# EAGLE design thermo_r1 (EAGLE 9.2.2)
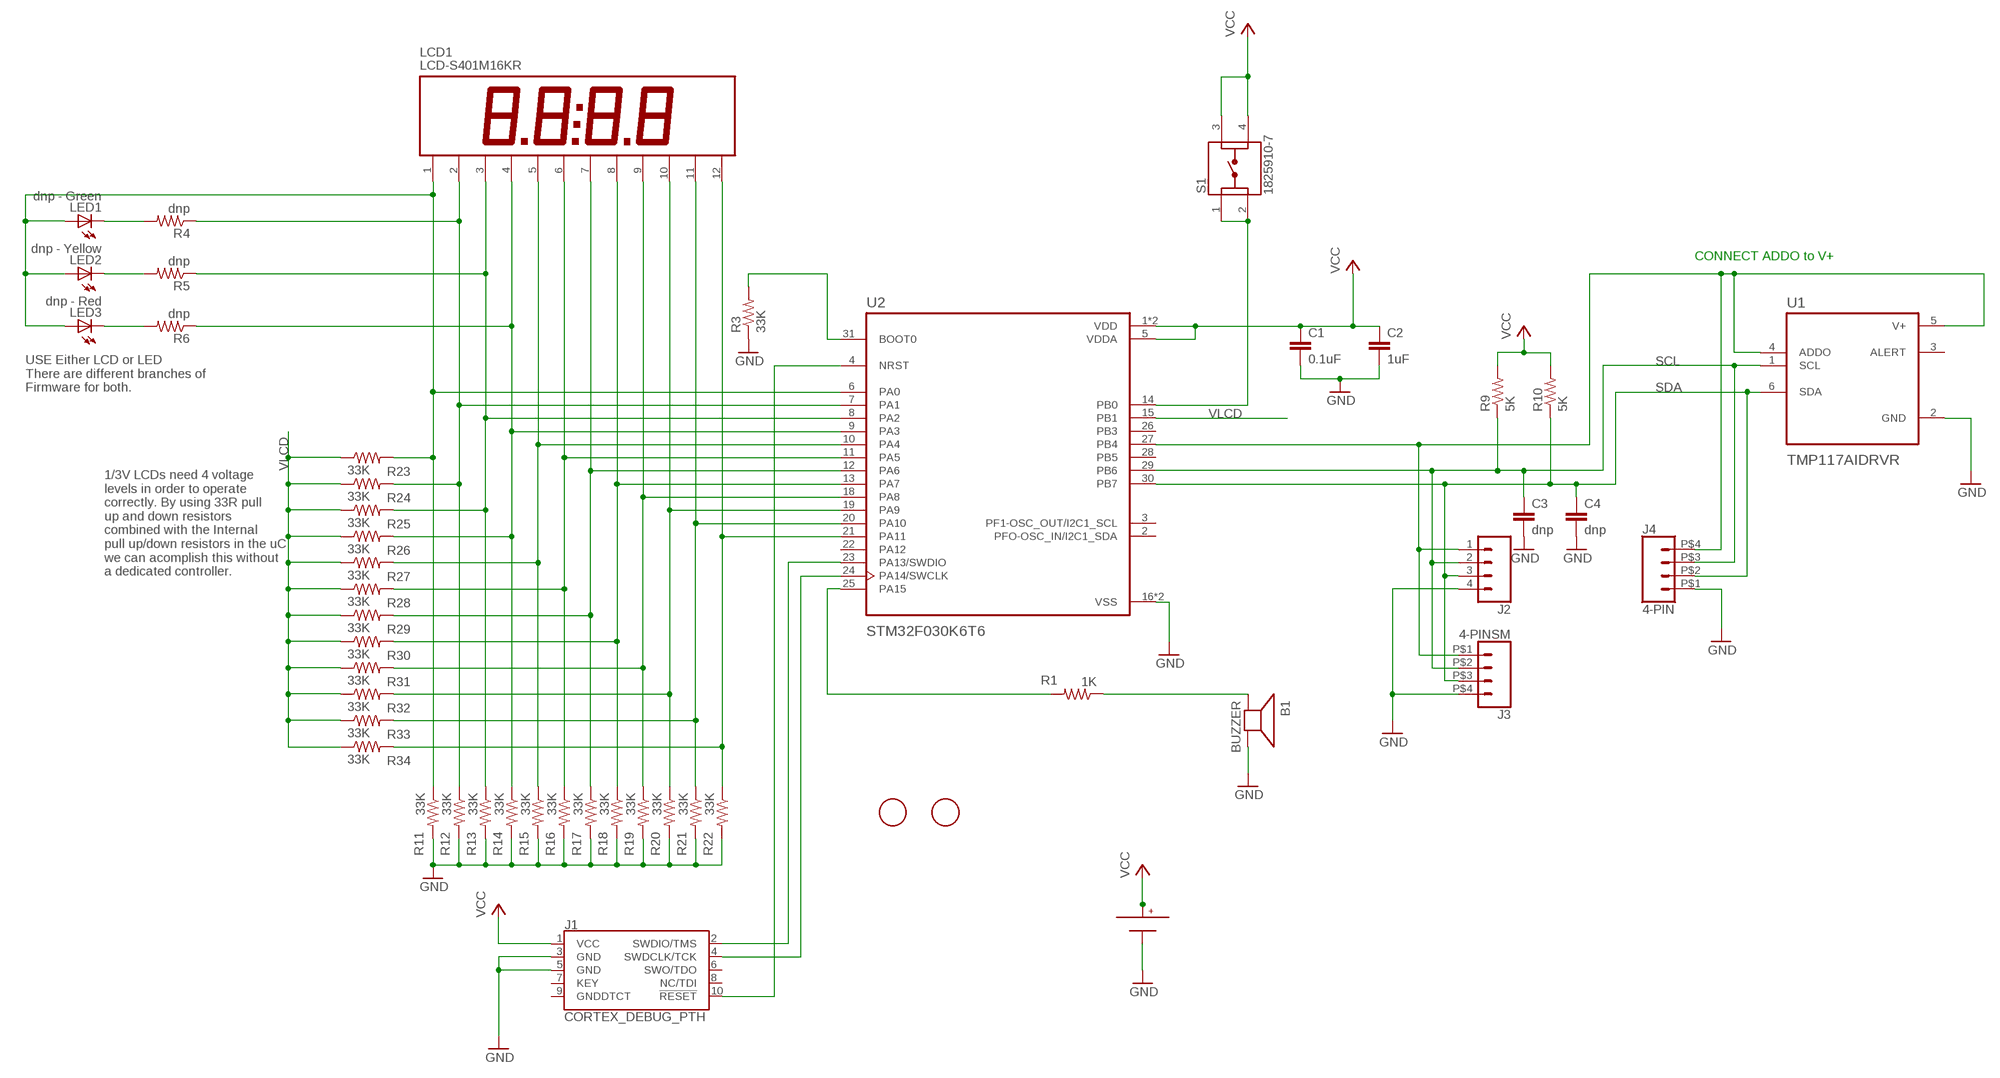
[diagram p0: schematic, sheet 1]

## Parts
B1  BUZZER  [PLKCS1212E]
BT1  BAT-HLD-001  [BAT-HLD-001]
C1  0.1uF  CAPACITORC0603  [R0603]
C2  1uF  CAPACITORC0603  [R0603]
C3  dnp  CAPACITORC0603  [R0603]
C4  dnp  CAPACITORC0603  [R0603]
J1  CORTEX_DEBUG_PTH  [2X5-PTH-1.27MM]
J2  CONN_041.27MM  [1X04_1.27MM]
J3  4-PINSM  [4PIN_1MM]
J4  4-PIN  [2X2PIN_1MM]
LCD1  LCD-S401M16KR  [LCD-S401M16KR]
LED1  dnp - Green  LEDCHIP-LED0805  [CHIP-LED0805]
LED2  dnp - Yellow  LEDCHIP-LED0805  [CHIP-LED0805]
LED3  dnp - Red  LEDCHIP-LED0805  [CHIP-LED0805]
R1  1K  RESISTORR0603  [R0603]
R3  33K  RESISTORR0603  [R0603]
R4  dnp  RESISTORR0603  [R0603]
R5  dnp  RESISTORR0603  [R0603]
R6  dnp  RESISTORR0603  [R0603]
R9  5K  RESISTORR0603  [R0603]
R10  5K  RESISTORR0603  [R0603]
R11  33K  RESISTORR0603  [R0603]
R12  33K  RESISTORR0603  [R0603]
R13  33K  RESISTORR0603  [R0603]
R14  33K  RESISTORR0603  [R0603]
R15  33K  RESISTORR0603  [R0603]
R16  33K  RESISTORR0603  [R0603]
R17  33K  RESISTORR0603  [R0603]
R18  33K  RESISTORR0603  [R0603]
R19  33K  RESISTORR0603  [R0603]
R20  33K  RESISTORR0603  [R0603]
R21  33K  RESISTORR0603  [R0603]
R22  33K  RESISTORR0603  [R0603]
R23  33K  RESISTORR0603  [R0603]
R24  33K  RESISTORR0603  [R0603]
R25  33K  RESISTORR0603  [R0603]
R26  33K  RESISTORR0603  [R0603]
R27  33K  RESISTORR0603  [R0603]
R28  33K  RESISTORR0603  [R0603]
R29  33K  RESISTORR0603  [R0603]
R30  33K  RESISTORR0603  [R0603]
R31  33K  RESISTORR0603  [R0603]
R32  33K  RESISTORR0603  [R0603]
R33  33K  RESISTORR0603  [R0603]
R34  33K  RESISTORR0603  [R0603]
S1  1825910-7  [SW_1825910-7]
U1  TMP117AIDRVR  [SON65P200X200X80-7N]
U2  STM32F030K6T6  [QFP80P900X900X160-32N]
U$5  FIDUCIAL  [FIDUCIAL_1MM]
U$6  FIDUCIAL  [FIDUCIAL_1MM]

## Nets
GND: B1.P$2(-) BT1.- C1.2 C2.2 C3.2 C4.2 J1.3(GND) J1.5(GND) J2.4 J3.P$4 J4.P$1 R3.1 R11.2 R12.2 R13.2 R14.2 R15.2 R16.2 R17.2 R18.2 R19.2 R20.2 R21.2 R22.2 U1.2(GND) U2.16(VSS) U2.32(VSS)
N$1: J1.4(SWDCLK/TCK) U2.24(PA14/SWCLK)
N$2: LCD1.2 R4.1 R12.1 R24.2 U2.7(PA1)
N$3: LCD1.3 R5.1 R13.1 R25.2 U2.8(PA2)
N$4: LCD1.4 R6.1 R14.1 R26.2 U2.9(PA3)
N$5: LCD1.5 R15.1 R27.2 U2.10(PA4)
N$6: LCD1.6 R16.1 R28.2 U2.11(PA5)
N$7: LCD1.7 R17.1 R29.2 U2.12(PA6)
N$8: LCD1.8 R18.1 R30.2 U2.13(PA7)
N$9: LCD1.9 R19.1 R31.2 U2.18(PA8)
N$10: LCD1.10 R20.1 R32.2 U2.19(PA9)
N$11: LCD1.11 R21.1 R33.2 U2.20(PA10)
N$12: LCD1.12 R22.1 R34.2 U2.21(PA11)
N$13: R1.2 U2.25(PA15)
N$14: R3.2 U2.31(BOOT0)
N$15: J1.10(!RESET) U2.4(NRST)
N$16: J1.2(SWDIO/TMS) U2.23(PA13/SWDIO)
N$17: B1.P$1(+) R1.1
N$23: LED3.C R6.2
N$24: S1.1 S1.2 U2.14(PB0)
N$25: LED2.C R5.2
N$26: LED1.C R4.2
N$27: LCD1.1 LED1.A LED2.A LED3.A R11.1 R23.2 U2.6(PA0)
SCL: C3.1 J2.2 J3.P$2 J4.P$3 R9.1 U1.1(SCL) U2.29(PB6)
SDA: C4.1 J2.3 J3.P$3 J4.P$2 R10.1 U1.6(SDA) U2.30(PB7)
VCC: BT1.+@1(+) BT1.+@2(+) C1.1 C2.1 J1.1(VCC) R9.2 R10.2 S1.3 S1.4 U2.1(VDD) U2.5(VDDA) U2.17(VDD)
VLCD: R23.1 R24.1 R25.1 R26.1 R27.1 R28.1 R29.1 R30.1 R31.1 R32.1 R33.1 R34.1 U2.15(PB1)
VT: J2.1 J3.P$1 J4.P$4 U1.4(ADDO) U1.5(V+) U2.27(PB4)
Unconnected: J1.6(SWO/TDO) J1.7(KEY) J1.8(NC/TDI) J1.9(GNDDTCT) U1.3(ALERT) U2.2(PFO-OSC_IN/I2C1_SDA) U2.3(PF1-OSC_OUT/I2C1_SCL) U2.22(PA12) U2.26(PB3) U2.28(PB5)

## Notes on the sheet
- CONNECT ADDO to V+
- USE Either LCD or LED
  There are different branches of 
  Firmware for both.
- 1/3V LCDs need 4 voltage
  levels in order to operate
  correctly. By using 33R pull 
  up and down resistors 
  combined with the Internal
  pull up/down resistors in the uC
  we can acomplish this without
  a dedicated controller.

## Library data of the parts
B1 = Passives:BUZZER
BT1 = BAT-HLD-001:BAT-HLD-001: Linx Technologies BAT-HLD-001 surface mount CR2032 single-cell holder digikey: BAT-HLD-001-ND; AVAILABILITY: Unavailable; DESCRIPTION: Battery Retainer Coin, 20.0mm 1 Cell SMD _SMT_ Tab; MF: Linx Technologies; MP: BAT-HLD-001; PACKAGE: None; PRICE: None
C1-C4 = Passives:CAPACITOR
J1 = SparkFun-Connectors:CORTEX_DEBUG: Cortex Debug Connector - 10 pin Supports JTAG debug, Serial Wire debug, and Serial Wire Viewer. PTH and SMD connector options available. General Connector Information <http://infocenter.arm.com/help/topic/com.arm.doc.faqs/attached/13634/cortex_debug_connectors.pdf> Products: PTH Connector <http://www.digikey.com/product-detail/en/cnc-tech/3220-10-0100-00/1175-1627-ND/3883661> -via Digi-Key SparkFun PSoc <https://www.sparkfun.com/products/13229> SparkFun T <https://www.sparkfun.com/products/13810>
J2 = SparkFun-Connectors:CONN_04: Multi connection point. Often used as Generic Header-pin footprint for 0.1 inch spaced/style header connections On any of the 0.1 inch spaced packages, you can populate with these: Break Away Headers - Straight <https://www.sparkfun.com/products/116> (PRT-00116) Break Away Male Headers - Right Angle <https://www.sparkfun.com/products/553> (PRT-00553) Female Headers <https://www.sparkfun.com/products/115> (PRT-00115) Break Away Headers - Machine Pin <https://www.sparkfun.com/products/117> (PRT-00117) Break Away Female Headers - Swiss Machine Pin <https://www.sparkfun.com/products/743> (PRT-00743) For SCREWTERMINALS and SPRING TERMINALS visit here: Screw Terimnals on SparkFun.com <https://www.sparkfun.com/search/results?term=Screw+Terminals> (5mm/3.5mm/2.54mm spacing) This device is also useful as a general connection point to wire up your design to another part of your project. Our various solder wires solder well into these plated through hole pads. Hook-Up Wire - Assortment (Stranded, 22 AWG) <https://www.sparkfun.com/products/11375> (PRT-11375) Hook-Up Wire - Assortment (Solid Core, 22 AWG) <https://www.sparkfun.com/products/11367> (PRT-11367) View the entire wire category on our website here <https://www.sparkfun.com/categories/141> Special notes: Molex polarized connector foot print use with SKU : PRT-08231 with associated crimp pins and housings. 1MM SMD Version SKU: PRT-10208
J3 J4 = connectors:4-PIN
LCD1 = LCD-S401M16KR:LCD-S401M16KR: LUMEX Four digit 0.17" 7-Segment Custom LCD Panel Reflective; AVAILABILITY: Unavailable; DESCRIPTION: Character LCD Display Module Reflective 7-Segment TN - Twisted Nematic Without Backlight 20.32mm x 10.16mm x 2.80mm; MF: Lumex Opto/Components; MP: LCD-S401M16KR; PACKAGE: None; PRICE: None
LED1-LED3 = led:LED: LED OSRAM: - CHIPLED LG R971, LG N971, LY N971, LG Q971, LY Q971, LO R971, LY R971 LH N974, LH R974 LS Q976, LO Q976, LY Q976 LO Q996 - Hyper CHIPLED LW Q18S LB Q993, LB Q99A, LB R99A - SideLED LS A670, LO A670, LY A670, LG A670, LP A670 LB A673, LV A673, LT A673, LW A673 LH A674 LY A675 LS A676, LA A676, LO A676, LY A676, LW A676 LS A679, LY A679, LG A679 - Hyper Micro SIDELED® LS Y876, LA Y876, LO Y876, LY Y876 LT Y87S - SmartLED LW L88C, LW L88S LB L89C, LB L89S, LG L890 LS L89K, LO L89K, LY L89K LS L896, LA L896, LO L896, LY L896 - TOPLED LS T670, LO T670, LY T670, LG T670, LP T670 LSG T670, LSP T670, LSY T670, LOP T670, LYG T670 LG T671, LOG T671, LSG T671 LB T673, LV T673, LT T673, LW T673 LH T674 LS T676, LA T676, LO T676, LY T676, LB T676, LH T676, LSB T676, LW T676 LB T67C, LV T67C, LT T67C, LS T67K, LO T67K, LY T67K, LW E67C LS E67B, LA E67B, LO E67B, LY E67B, LB E67C, LV E67C, LT E67C LW T67C LS T679, LY T679, LG T679 LS T770, LO T770, LY T770, LG T770, LP T770 LB T773, LV T773, LT T773, LW T773 LH T774 LS E675, LA E675, LY E675, LS T675 LS T776, LA T776, LO T776, LY T776, LB T776 LHGB T686 LT T68C, LB T68C - Hyper Mini TOPLED® LB M676 - Mini TOPLED Santana® LG M470 LS M47K, LO M47K, LY M47K Source: http://www.osram.convergy.de LUXEON: - LUMILED® LXK2-PW12-R00, LXK2-PW12-S00, LXK2-PW14-U00, LXK2-PW14-V00 LXK2-PM12-R00, LXK2-PM12-S00, LXK2-PM14-U00 LXK2-PE12-Q00, LXK2-PE12-R00, LXK2-PE12-S00, LXK2-PE14-T00, LXK2-PE14-U00 LXK2-PB12-K00, LXK2-PB12-L00, LXK2-PB12-M00, LXK2-PB14-N00, LXK2-PB14-P00, LXK2-PB14-Q00 LXK2-PR12-L00, LXK2-PR12-M00, LXK2-PR14-Q00, LXK2-PR14-R00 LXK2-PD12-Q00, LXK2-PD12-R00, LXK2-PD12-S00 LXK2-PH12-R00, LXK2-PH12-S00 LXK2-PL12-P00, LXK2-PL12-Q00, LXK2-PL12-R00 Source: www.luxeon.com KINGBRIGHT: KA-3528ASYC Source: www.kingbright.com
R1 R3-R6 R9-R34 = Passives:RESISTOR
S1 = 1825910-7:1825910-7: Switch Tactile OFF (ON) SPST Round Button PC Pins 0.05A 24VDC 100000Cycles 2.55N Thru-Hole Loose; AVAILABILITY: Unavailable; COMMENT: 1825910-7; CONFIGURATION_POLE-THROW: Single Pole - Single Throw; CONTACT_CURRENT_RATING: 50 mA; DESCRIPTION: Switch Tactile OFF _ON_ SPST Round Button PC Pins 0.05A 24VDC 100000Cycle 2.55N Thru-Hole Loose Piece; EU_ROHS_COMPLIANCE: Compliant; MF: TE Connectivity; MP: 1825910-7; PACKAGE: None; PRICE: None; TE_PURCHASE_URL: https://www.te.com/usa-en/product-1825910-7.html?te_bu=Cor&te_type=disp&te_campaign=seda_glo_cor-seda-global-disp-prtnr-fy19-seda-model-bom-cta_sma-317_1&elqCampaignId=32493
U1 = TMP117AIDRVR:TMP117AIDRVR: None; AVAILABILITY: Unavailable; DESCRIPTION: Temperature Sensor Digital, Local -55°C ~ 150°C 16 b 6-WSON _2x2_; MF: Texas Instruments; MP: TMP117AIDRVR; PACKAGE: WDFN-6 Texas Instruments; PRICE: None
U2 = STM32F030K6T6:STM32F030K6T6: None; AVAILABILITY: Unavailable; DESCRIPTION: ARM® Cortex®-M0 STM32F0 Microcontroller IC 32-Bit 48MHz 32KB _32K x 8_ FLASH 32-LQFP _7x7_; MF: STMicroelectronics; MP: STM32F030K6T6; PACKAGE: LQFP-32 STMicroelectronics; PRICE: None
U$5 U$6 = adafruit:FIDUCIAL: For use by pick and place machines to calibrate the vision/machine, 1mm By microbuilder.eu

## Board
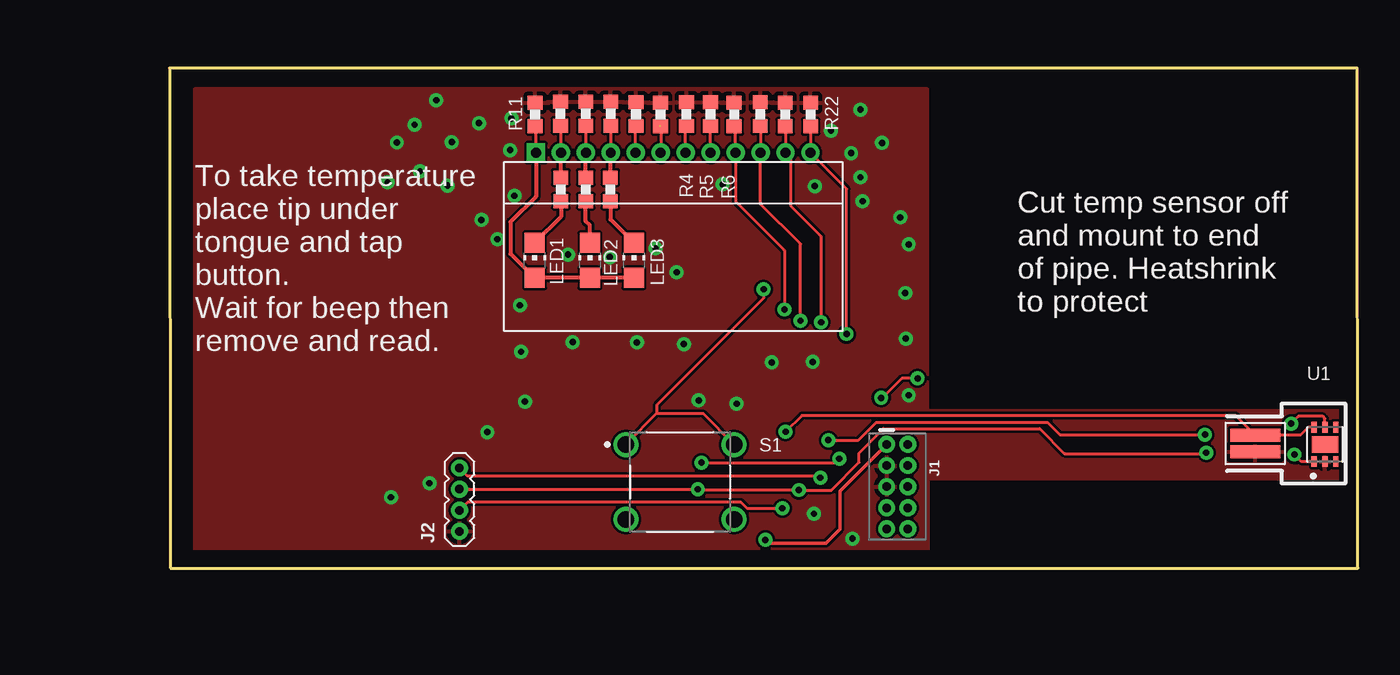
[diagram p1: board, top side]
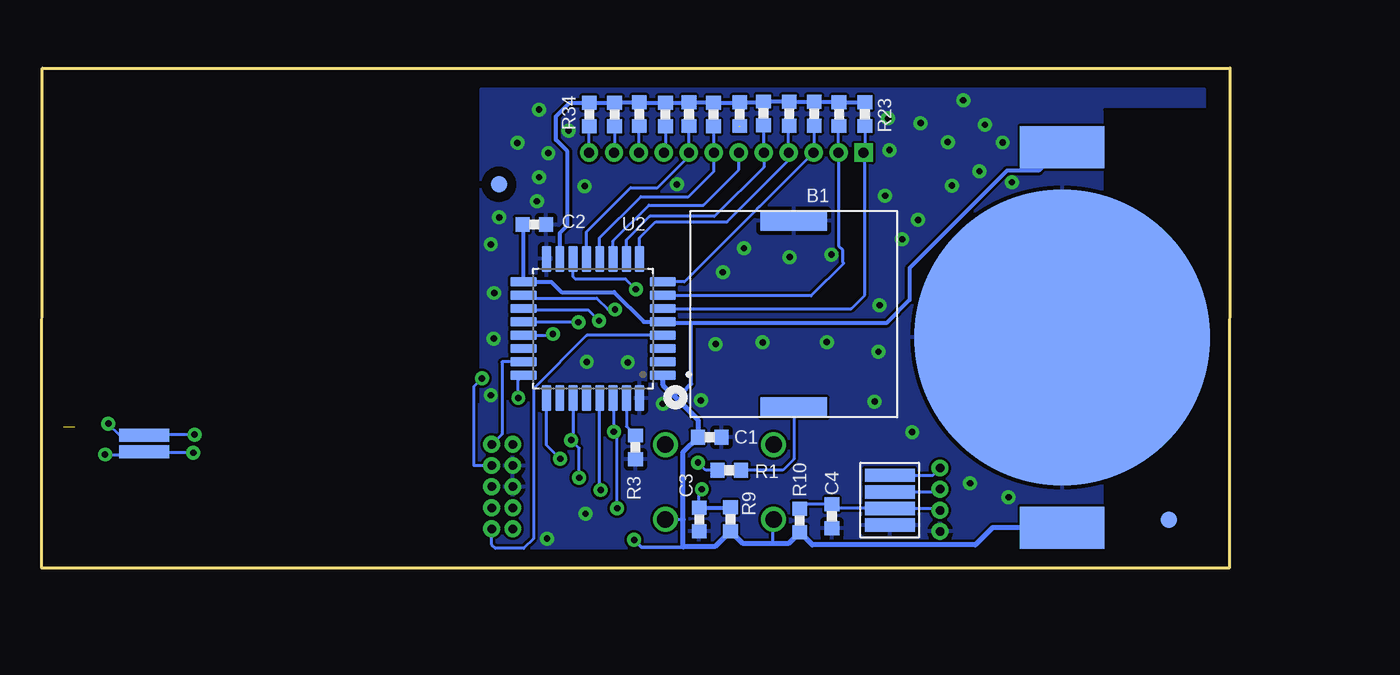
[diagram p2: board, bottom side, seen from below]

Size 71.42 x 30.05 mm. Coordinates in mm from the lower left corner, seen from the top.
Outline: 0.05,0 71.42,0 71.37,30.05 0,30.05 0.05,0
Copper layers (1*16): Top 0.035mm / dielectric 1.5mm / Bottom 0.035mm
Design rules "default *": minimum track width 7mil, minimum drill 15mil, track to track 6mil, track to pad 6mil, pad to pad 6mil, via to via 6mil, smd to smd 6mil, copper to edge 40mil, drill to drill 6mil, minimum pad ring 10mil, minimum via ring 9mil, stop-mask expansion 4mil, vias tented up to drill 16mil, thermal gap 10mil

### Footprints (pad centres in the part's own frame; a part is rotated, then mirrored left to right if it is on the bottom)
PLKCS1212E = smd 1.2 x 4: P$1 -5.6,0; P$2 5.6,0
BAT-HLD-001 = smd 2.54 x 5.08: +@1 -11.43,0; +@2 11.43,0 | smd 17.78 x 17.78: - 0,0
R0603 = smd 0.838 x 0.889: 1 -0.711,0; 2 0.711,0
2X5-PTH-1.27MM = drill 0.508 pad 1: 1 -2.54,-0.635; 2 -2.54,0.635; 3 -1.27,-0.635; 4 -1.27,0.635; 5 0,-0.635; 6 0,0.635; 7 1.27,-0.635; 8 1.27,0.635; 9 2.54,-0.635; 10 2.54,0.635
1X04_1.27MM = drill 0.508 pad 1: 1 0,0; 2 1.27,0; 3 2.54,0; 4 3.81,0
4PIN_1MM = smd 3 x 0.8: P$1 0,1.5; P$2 0,0.5; P$3 0,-0.5; P$4 0,-1.5
2X2PIN_1MM = smd 3 x 0.8: P$1 0,0.5; P$2 0,-0.5 | smd 3 x 0.8 bottom: P$3 0,0.5; P$4 0,-0.5
LCD-S401M16KR = drill 0.6 square: 1 0,0 | drill 0.6: 2 1.5,0; 3 3,0; 4 4.5,0; 5 6,0; 6 7.5,0; 7 9,0; 8 10.5,0; 9 12,0; 10 13.5,0; 11 15,0; 12 16.5,0
CHIP-LED0805 = smd 1.2 x 1.2: A 0,-1.05; C 0,1.05
SW_1825910-7 = drill 0.99: 1 -3.25,2.25; 2 3.25,2.25; 3 -3.25,-2.25; 4 3.25,-2.25
SON65P200X200X80-7N = smd 0.66 x 0.32: 1 -1.03,0.65; 2 -1.03,0; 3 -1.03,-0.65; 4 1.03,-0.65; 5 1.03,0; 6 1.03,0.65 | smd 1 x 1.6: 7 0,0
QFP80P900X900X160-32N = smd 1.56 x 0.55: 1 -4.18,2.8; 2 -4.18,2; 3 -4.18,1.2; 4 -4.18,0.4; 5 -4.18,-0.4; 6 -4.18,-1.2; 7 -4.18,-2; 8 -4.18,-2.8; 17 4.18,-2.8; 18 4.18,-2; 19 4.18,-1.2; 20 4.18,-0.4; 21 4.18,0.4; 22 4.18,1.2; 23 4.18,2; 24 4.18,2.8 | smd 0.55 x 1.56: 9 -2.8,-4.18; 10 -2,-4.18; 11 -1.2,-4.18; 12 -0.4,-4.18; 13 0.4,-4.18; 14 1.2,-4.18; 15 2,-4.18; 16 2.8,-4.18; 25 2.8,4.18; 26 2,4.18; 27 1.2,4.18; 28 0.4,4.18; 29 -0.4,4.18; 30 -1.2,4.18; 31 -2,4.18; 32 -2.8,4.18
FIDUCIAL_1MM = smd 1 x 1: 1 0,0

### Placement (x,y rotation side)
B1  26.21,15.27 90 bottom
BT1  10.08,13.87 90 bottom
C1  31.27,7.87 0 bottom
C2  41.81,20.65 0 bottom
C3  31.9,2.92 270 bottom
C4  23.93,3.12 270 bottom
J1  43.74,4.9 270 top
J2  17.42,6.02 270 top
J3  20.45,4.09 0 bottom
J4  65.25,7.49 180 top
LCD1  22.02,24.97 0 top
LED1  21.95,18.49 0 top
LED2  25.27,18.49 0 top
LED3  27.91,18.49 0 top
R1  30.1,5.89 180 bottom
R3  35.74,7.26 90 bottom
R4  23.52,22.76 270 top
R5  25.02,22.76 270 top
R6  26.49,22.76 270 top
R9  30.02,2.95 270 bottom
R10  25.86,2.87 270 bottom
R11  21.97,27.25 90 top
R12  23.49,27.3 90 top
R13  25.02,27.3 90 top
R14  26.52,27.3 90 top
R15  28.04,27.28 90 top
R16  29.51,27.25 90 top
R17  31.06,27.28 90 top
R18  32.51,27.28 90 top
R19  33.93,27.25 90 top
R20  35.51,27.28 90 top
R21  37.01,27.25 90 top
R22  38.53,27.25 90 top
R23  21.95,27.28 270 bottom
R24  23.49,27.28 270 bottom
R25  24.99,27.3 270 bottom
R26  26.49,27.3 270 bottom
R27  28.04,27.33 270 bottom
R28  29.46,27.28 270 bottom
R29  31.04,27.25 270 bottom
R30  32.51,27.28 270 bottom
R31  33.93,27.25 270 bottom
R32  35.51,27.28 270 bottom
R33  36.98,27.25 270 bottom
R34  38.51,27.25 270 bottom
S1  30.68,5.18 0 top
U1  69.44,7.44 90 top
U2  38.28,14.4 180 bottom
U$5  3.68,2.92 0 bottom
U$6  43.94,23.06 0 bottom

### Tracks (layer width: path | path; a pad name or v marks a point on that pad's centre or on a via)
GND  (via drill 0.38)
  Top 0.178: J4.P$1 66.32,6.99 | 13.33,4.27 v13.31,4.27
  other vias: 19.1,8.18 36.2,12.37 38.66,12.4 44.42,10.39 44.25,13.79 44.22,16.54 44.42,19.46 42.82,25.55 26.47,18.69 23.95,18.85 19.71,19.76 20.73,22.38 20.47,25.12 13.67,25.58 16.71,22.99 18.75,20.93 15.62,5.11 13.11,23.19 38.73,3.28 31.8,10.08 21.36,10.01 21.13,13 30.91,13.46 33.25,23.06 38.79,22.96 29.21,19.23 24.23,13.59 28.09,13.56 34.09,9.88 41.05,1.78 18.59,26.75 16.97,25.6 15.06,23.85 14.73,26.64 16.03,28.12 20.55,27.03 39.75,26.29 40.97,24.94 41.53,23.5 41.66,22.05 43.92,21.08 41.53,27.56 30.48,17.78 21.06,15.8
  pour Top: 1.52,28.83 45.54,28.83 45.54,9.5 71.02,9.5 71.02,5.33 45.57,5.33 45.57,0.81 1.52,0.81
  pour Bottom: 1.52,28.8 45.03,28.8 45.03,9.83 70.51,9.83 70.51,5.66 45.06,5.66 45.06,1.14 1.52,1.14
  cutout Bottom: 7.47,0.61 7.47,27.51 7.49,27.53 0.71,27.53 0.71,0.61
N$1  (via drill 0.38)
  Top 0.178: v44.96,11.4 44.02,11.4 42.85,10.24 v42.77,10.24
  Bottom 0.178: J1.4 45.44,6.17 45.44,10.92 v44.96,11.4 | v42.77,10.24 42.77,11.29 U2.24
N$2
  Top 0.178: R12.1 23.49,24.99 LCD1.2
  Top 0.254: R4.1 LCD1.2
  Bottom 0.178: U2.7 34.05,16.36 25.17,16.36 23.22,18.31 23.29,18.39 23.29,19.12 23.52,19.35 LCD1.2 23.52,26.54 R24.2
N$3
  Top 0.178: LCD1.3 R13.1
  Top 0.254: R5.1 LCD1.3
  Bottom 0.178: R25.2 24.99,25 LCD1.3 28.28,21.71 28.31,21.71 28.45,21.57 28.45,21.54 32.79,17.2 U2.8
  Bottom 0.254: 25.07,24.92 LCD1.3
N$4
  Top 0.178: R14.1 LCD1.4 26.49,24.94
  Top 0.254: R6.1 26.49,24.94 LCD1.4
  Bottom 0.178: R26.2 26.52,26.56 LCD1.4 26.52,24.51 30.23,20.8 34.52,20.8 35.48,19.84 U2.9
N$5
  Top 0.178: LCD1.5 28.02,26.55 R15.1
  Bottom 0.178: R27.2 28.02,26.6 LCD1.5 28.02,24.1 30.99,21.13 34.87,21.13 36.3,19.71 36.3,18.6 U2.10
N$6  (1 unrouted)
  Top 0.178: R16.1 29.54,26.52 29.54,24.95
  Top 0.254: 29.54,24.95 LCD1.6
  Bottom 0.178: U2.11 37.08,19.67 34.92,21.82 31.65,21.82 29.52,23.95 LCD1.6
  Bottom 0.254: 37.13,18.64 U2.11
N$7
  Top 0.178: LCD1.7 31.02,26.53 R17.1
  Bottom 0.178: R29.2 31.04,24.98 LCD1.7 31.02,23.84 32.54,22.33 35.41,22.33 37.88,19.86 U2.12
N$8
  Top 0.178: LCD1.8 R30.2
  Bottom 0.178: R30.2 LCD1.8 32.52,24.74 34.4,22.86 36.02,22.86 38.67,20.21 U2.13
N$9  (via drill 0.38)
  Top 0.178: v36.96,15.54 36.96,19.1 34.02,22.04 LCD1.9 34.02,26.46 R31.2
  Bottom 0.178: U2.18 42.28,16.22 38.06,16.22 37.38,15.54 v36.96,15.54 | R31.2 33.93,25.06 LCD1.9
N$10  (via drill 0.38)
  Top 0.178: v37.92,14.87 37.92,19.48 35.52,21.88 LCD1.10 35.51,24.98 R32.2
  Bottom 0.178: U2.19 42.38,15.53 38.58,15.53 v37.92,14.87 | LCD1.10 35.52,26.56 R32.2
N$11  (via drill 0.38)
  Top 0.178: v39.17,14.78 39.17,19.94 37.33,21.78 37.33,24.66 LCD1.11 R21.1
  Bottom 0.178: 42.44,14.78 U2.20 39.19,14.8 | R33.2 36.98,25.01 LCD1.11
  Bottom 0.254: 39.19,14.8 v39.17,14.78
N$12  (via drill 0.38)
  Top 0.178: v40.69,14.07 40.69,22.8 LCD1.12 38.53,24.98 R22.1
  Bottom 0.178: U2.21 40.76,14 v40.69,14.07 | LCD1.12 38.52,26.53 R34.2
N$13  (via drill 0.38)
  Top 0.178: v31.98,6.35 40.03,6.35 v40.26,6.58
  Bottom 0.178: R1.2 31.52,5.89 v31.98,6.35 | v40.26,6.58 41.08,7.4 U2.25
N$14
  Bottom 0.178: U2.31 36.28,8.52 R3.2
N$15
  Bottom 0.178: U2.4 38.66,14 41.86,10.8 41.86,1.78 42.44,1.19 44.14,1.19 44.37,1.42 J1.10
N$16
  Bottom 0.178: U2.23 43.76,12.4 43.76,8.05 J1.2
N$17
  Bottom 0.178: B1.P$1 26.21,6.55 26.87,5.89 R1.1
N$23
  Top 0.254: R6.2 26.49,20.96 LED3.C
N$24  (via drill 0.38)
  Top 0.178: v35.71,16.76 35.71,16.23 29.27,9.79 29.27,9.3 | 29.27,9.3 27.43,7.46 S1.1 | 29.27,9.3 30.76,9.3 31.22,9.3 32.07,9.3 S1.2
  Bottom 0.178: v35.71,16.76 36.32,17.37 39.34,17.37 39.48,17.51 U2.14
N$25
  Top 0.254: LED2.C 25.27,20.6 25.02,20.85 R5.2
N$26
  Top 0.254: R4.2 23.52,21.12 LED1.C
N$27
  Top 0.178: LCD1.1 22.02,26.49 R11.1
  Top 0.254: 27.97,17.49 LED3.A LED2.A LED1.A 20.5,18.89 20.5,20.8 22.02,22.33 LCD1.1
  Bottom 0.178: R23.2 21.95,25.02 | 21.95,25.02 22.01,24.96 | U2.6 22.75,15.6 21.95,16.41 21.95,25.02
  Bottom 0.254: LCD1.1 22.01,24.96 21.95,24.89
SCL  (via drill 0.38)
  Top 0.178: 17.47,4.7 J2.2 v31.75,4.75 | v62.31,6.93 62.26,6.88 53.8,6.88 52.3,8.38 42.9,8.38 41.44,6.92 41.44,6.36 39.78,4.7 v37.82,4.7 31.8,4.7 v31.75,4.75 | U1.1 68.03,6.41 v67.61,6.83 | v31.75,4.75 31.78,4.72
  Bottom 0.178: v67.61,6.83 65.41,6.83 J4.P$3 65.19,6.93 v62.31,6.93 | U2.29 37.88,4.76 v37.82,4.7 | J3.P$2 17.58,4.59 J2.2 | C3.1 31.9,4.45 31.95,4.5 31.75,4.7 v31.75,4.75
  Bottom 0.254: 31.88,3.66 C3.1 30.05,3.63 R9.1
SDA  (via drill 0.38)
  Top 0.178: v37.03,8.2 38,9.17 64.08,9.17 J4.P$2 67.97,7.99 68.45,8.47 U1.6 | v36.83,3.61 36.83,3.58 34.73,3.58 34.34,3.97 17.92,3.97 J2.3
  Bottom 0.178: v37.03,8.2 37.03,8.31 | 37.03,8.31 37.03,10.18 U2.30 | 37.03,8.31 36.83,8.1 v36.83,3.61 | J2.3 17.53,3.59 J3.P$3 23.68,3.59 C4.1 25.4,3.83 25.76,3.48 | 25.74,3.46 25.76,3.48 | 25.76,3.48 R10.1
VCC  (via drill 0.38)
  Top 0.203: J1.1 40.28,4.62 40.28,2.34 39.45,1.5 35.81,1.5 v35.81,1.7
  Bottom 0.178: 27.46,1.47 27.46,2.91 S1.3 | 32.87,2.92 S1.4
  Bottom 0.203: v35.81,1.7 35.38,1.27 32.87,1.27
  Bottom 0.254: C2.1 42.46,20.59 U2.17 40.8,17.2 40.19,16.59 37.02,16.59 35.23,14.8 U2.5 34.03,14.73 32.38,14.73 | BT1.+@2 11.49,23.89 13.4,23.89 19.25,18.03 19.25,16.13 20.65,14.73 32.38,14.73 | 33.6,10.54 32.92,10.54 32.38,11.07 32.38,14.73
  Bottom 0.305: BT1.+@1 14.27,2.44 15.32,1.4 25.09,1.4 R10.2 26.54,1.47 27.46,1.47 29.26,1.47 R9.2 30.96,1.29 32.84,1.29 32.87,1.27 32.87,2.92 32.87,6.99 C1.1 31.98,8.91 33.6,10.54 34.1,11.04 U2.1
VLCD
  Bottom 0.254: R23.1 R24.1 23.52,28.02 R25.1 R26.1 26.52,28.04 R27.1 28.09,27.99 R28.1 29.49,27.96 R29.1 31.06,27.99 R30.1 32.54,27.96 R31.1 35.48,27.96 R32.1 36.96,27.99 R33.1 R34.1 39.7,27.96 40.51,27.15 40.51,25.73 39.83,25.04 39.83,20.6 40.28,20.15 U2.15
VT  (via drill 0.38)  (1 unrouted)
  Top 0.178: v67.41,8.69 67.84,9.12 69.32,9.12 69.44,8.99 U1.5 | v39.6,7.7 41.42,7.7 42.48,8.76 52.77,8.76 53.5,8.03 v62.23,8.03 | J2.1 17.91,5.54 39.01,5.54 v39.12,5.44
  Bottom 0.178: v67.41,8.69 67.41,8.66 66.74,7.99 J4.P$4 65.22,8.03 v62.23,8.03 | J3.P$1 17.85,5.59 J2.1 | U2.27 39.48,7.82 v39.6,7.7 39.12,7.21 v39.12,5.44

### Text on the board
tPlace: Cut temp sensor off / and mount to end / of pipe. Heatshrink / to protect | To take temperature / place tip under / tongue and tap / button. / Wait for beep then / remove and read.